# Altium schematic sheet 000_Sch-Final.SchDoc
size A4; SheetNumber: 1; SheetTotal: 1
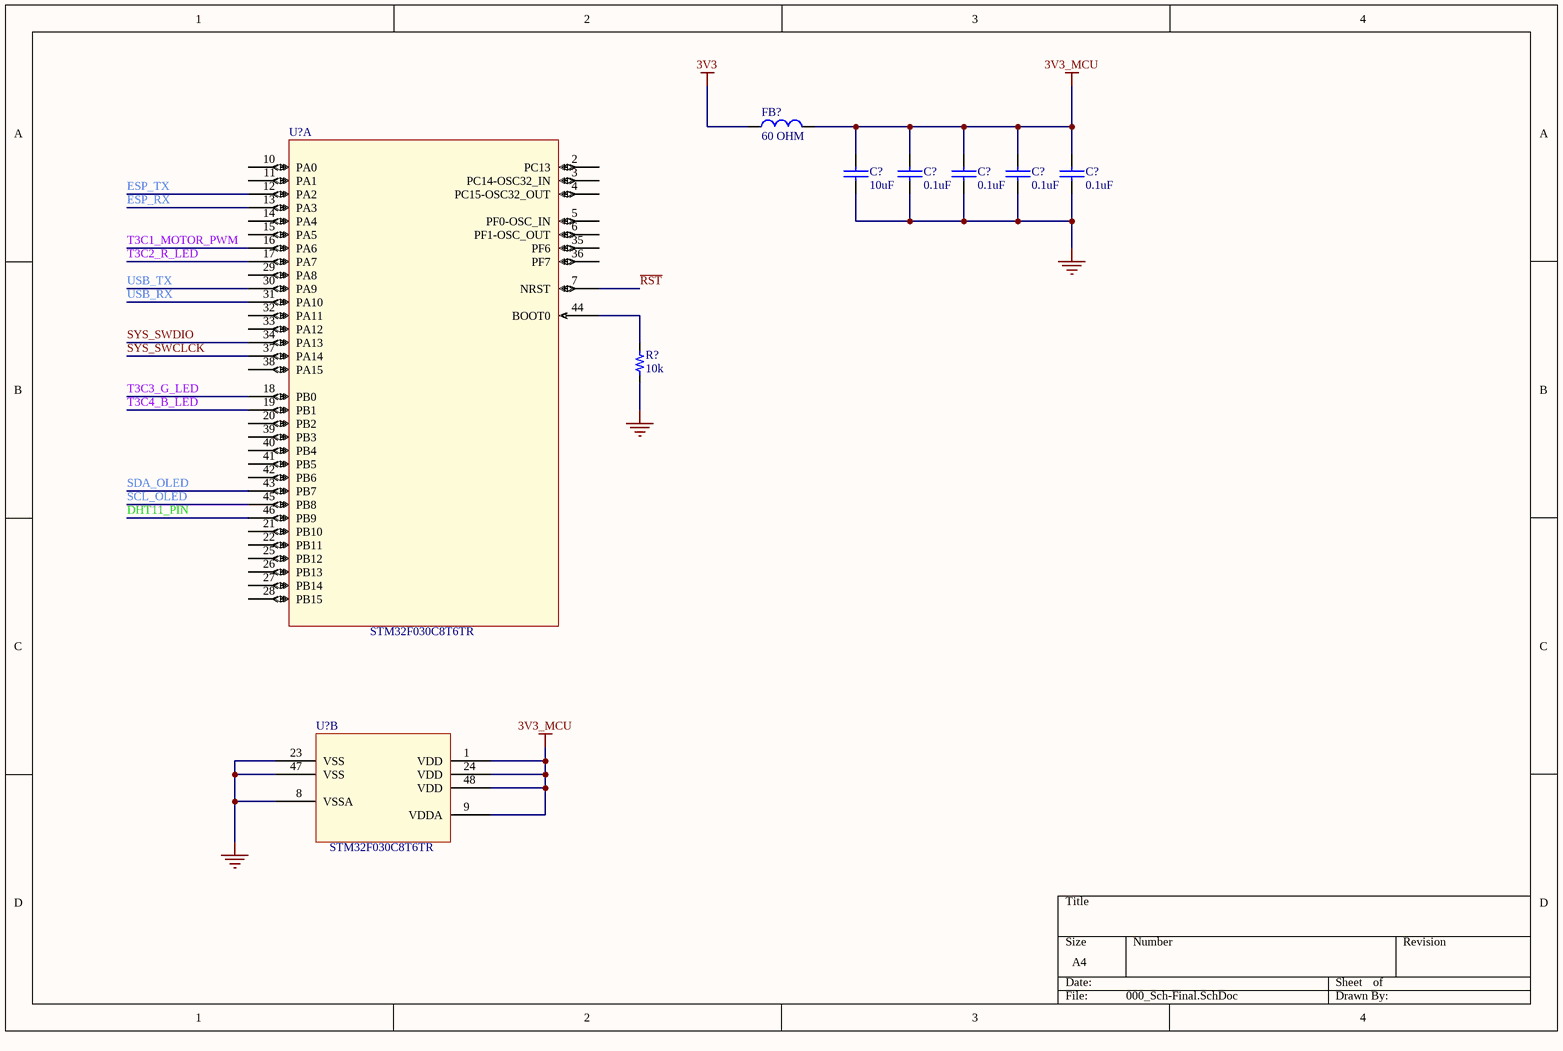
[diagram p0: 000_Sch-Final.SchDoc]

## Parts
(Parts that share a designator on the sheet are numbered #1, #2 ... from top to bottom, then left to right.)
C?#1  value 10uF  [0805_cap]  (hidden comment: 10uF 25V)
C?#2  value 0.1uF  [0603_cap]  (hidden comment: 0.1uF 50V)
C?#3  value 0.1uF  [0603_cap]  (hidden comment: 0.1uF 50V)
C?#4  value 0.1uF  [0603_cap]  (hidden comment: 0.1uF 50V)
C?#5  value 0.1uF  [0603_cap]  (hidden comment: 0.1uF 50V)
FB?  value 60 OHM  [0603_fb]  (hidden comment: 60OHM 2A)
R?  value 10k  [0603_res]  (hidden comment: 10k 1/10W)
U?#1  STM32F030C8T6TR  [LQFP48_7x7mm]  (part A of 2)
U?#2  STM32F030C8T6TR  [LQFP48_7x7mm]  (part B of 2)

## Nets
3V3: FB?.1
3V3_MCU: C?#1.1 C?#2.1 C?#3.1 C?#4.1 C?#5.1 FB?.2 U?#2.1(VDD) U?#2.9(VDDA) U?#2.24(VDD) U?#2.48(VDD)
GND: C?#1.2 C?#2.2 C?#3.2 C?#4.2 C?#5.2 R?.1 U?#2.8(VSSA) U?#2.23(VSS) U?#2.47(VSS)
DHT11_PIN: U?#1.46(PB9)
ESP_RX: U?#1.13(PA3)
ESP_TX: U?#1.12(PA2)
~{RST}: U?#1.7(NRST)
SCL_OLED: U?#1.45(PB8)
SDA_OLED: U?#1.43(PB7)
SYS_SWCLCK: U?#1.37(PA14)
SYS_SWDIO: U?#1.34(PA13)
T3C1_MOTOR_PWM: U?#1.16(PA6)
T3C2_R_LED: U?#1.17(PA7)
T3C3_G_LED: U?#1.18(PB0)
T3C4_B_LED: U?#1.19(PB1)
USB_RX: U?#1.31(PA10)
USB_TX: U?#1.30(PA9)
NetR?_2: R?.2 U?#1.44(BOOT0)

Not connected (* = marked no-connect by the designer): U?#1 2(PC13) 3(PC14-OSC32_IN) 4(PC15-OSC32_OUT) 5(PF0-OSC_IN) 6(PF1-OSC_OUT) 10(PA0) 11(PA1) 14(PA4) 15(PA5) 20(PB2) 21(PB10) 22(PB11) 25(PB12) 26(PB13) 27(PB14) 28(PB15) 29(PA8) 32(PA11) 33(PA12) 35(PF6) 36(PF7) 38(PA15) 39(PB3) 40(PB4) 41(PB5) 42(PB6)

## Library data of the parts
C?#1 = Cap_10uF_0805_25V_: 25V 10uF X5R ±10% 0805 Multilayer Ceramic Capacitors MLCC - SMD/SMT ROHS; Manufacturer: Samsung Electro-Mechanics; Manufacturer Part Number: CL21A106KAYNNNE; Supplier 1: LCSC; Supplier Part Number 1: C15850; ComponentLink1Description: LCSC; ComponentLink1URL: https://lcsc.com/product-detail/Multilayer-Ceramic-Capacitors-MLCC-SMD-SMT_Samsung-Electro-Mechanics-CL21A106KAYNNNE_C15850.html
C?#2-C?#5 = Cap_0.1uF_0603_50V: 50V 100nF Y5V -20%~+80% 0603 Multilayer Ceramic Capacitors MLCC - SMD/SMT ROHS; Manufacturer: Walsin Tech Corp; Manufacturer Part Number: 0603F104Z500CT; Supplier 1: LCSC; Supplier Part Number 1: C83060; ComponentLink1Description: LCSC; ComponentLink1URL: https://www.lcsc.com/product-detail/Multilayer-Ceramic-Capacitors-MLCC-SMD-SMT_Walsin-Tech-Corp-0603F104Z500CT_C83060.html
FB? = FB_60_0603_2A: 2A 1 100mΩ 60Ω@100MHz ±25% 0603 Ferrite Beads ROHS; Manufacturer: TAI-TECH; Manufacturer Part Number: HCB1608KF-600T20; ComponentLink1Description: LCSC; ComponentLink1URL: https://www.lcsc.com/product-detail/Ferrite-Beads_TAI-TECH-HCB1608KF-600T20_C369516.html; Supplier 1: LCSC; Supplier Part Number 1: C369516
R? = Res_10k_0603_1/10W: RES SMD 10k OHM 5% 1/10W 0603; Manufacturer: FOJAN; Manufacturer Part Number: FRC0603J103TS; ComponentLink1URL: https://www.lcsc.com/product-detail/Chip-Resistor-Surface-Mount_FOJAN-FRC0603J103TS_C2930027.html; Supplier 1: LCSC; Supplier Part Number 1: C2930027; ComponentLink1Description: LCSC
U?#1 U?#2 = IC_STM32F030C8T6TR_LQFP48_7x7MM: IC MCU 32BIT 64KB FLASH 48LQFP; Manufacturer: STMicroelectronics; Manufacturer part number: STM32F030C8T6TR; Supplier 1: LCSC; Supplier Part Number 1: C23922; ComponentLink1Description: LCSC; ComponentLink1URL: https://www.lcsc.com/product-detail/ST-Microelectronics_STMicroelectronics-STM32F030C8T6_C23922.html